# EasyEDA Pro project robot_arm_board.eprj

# Schematic Schematic1
Board Name: Board1; Create Date: 2024-10-25; Page Name: P1; Project Name: robot_arm_board; Schematic Name: Schematic1; Update Date: 2024-11-02; Company: 嘉立创EDA; Page Size: A4; Version: V1.0
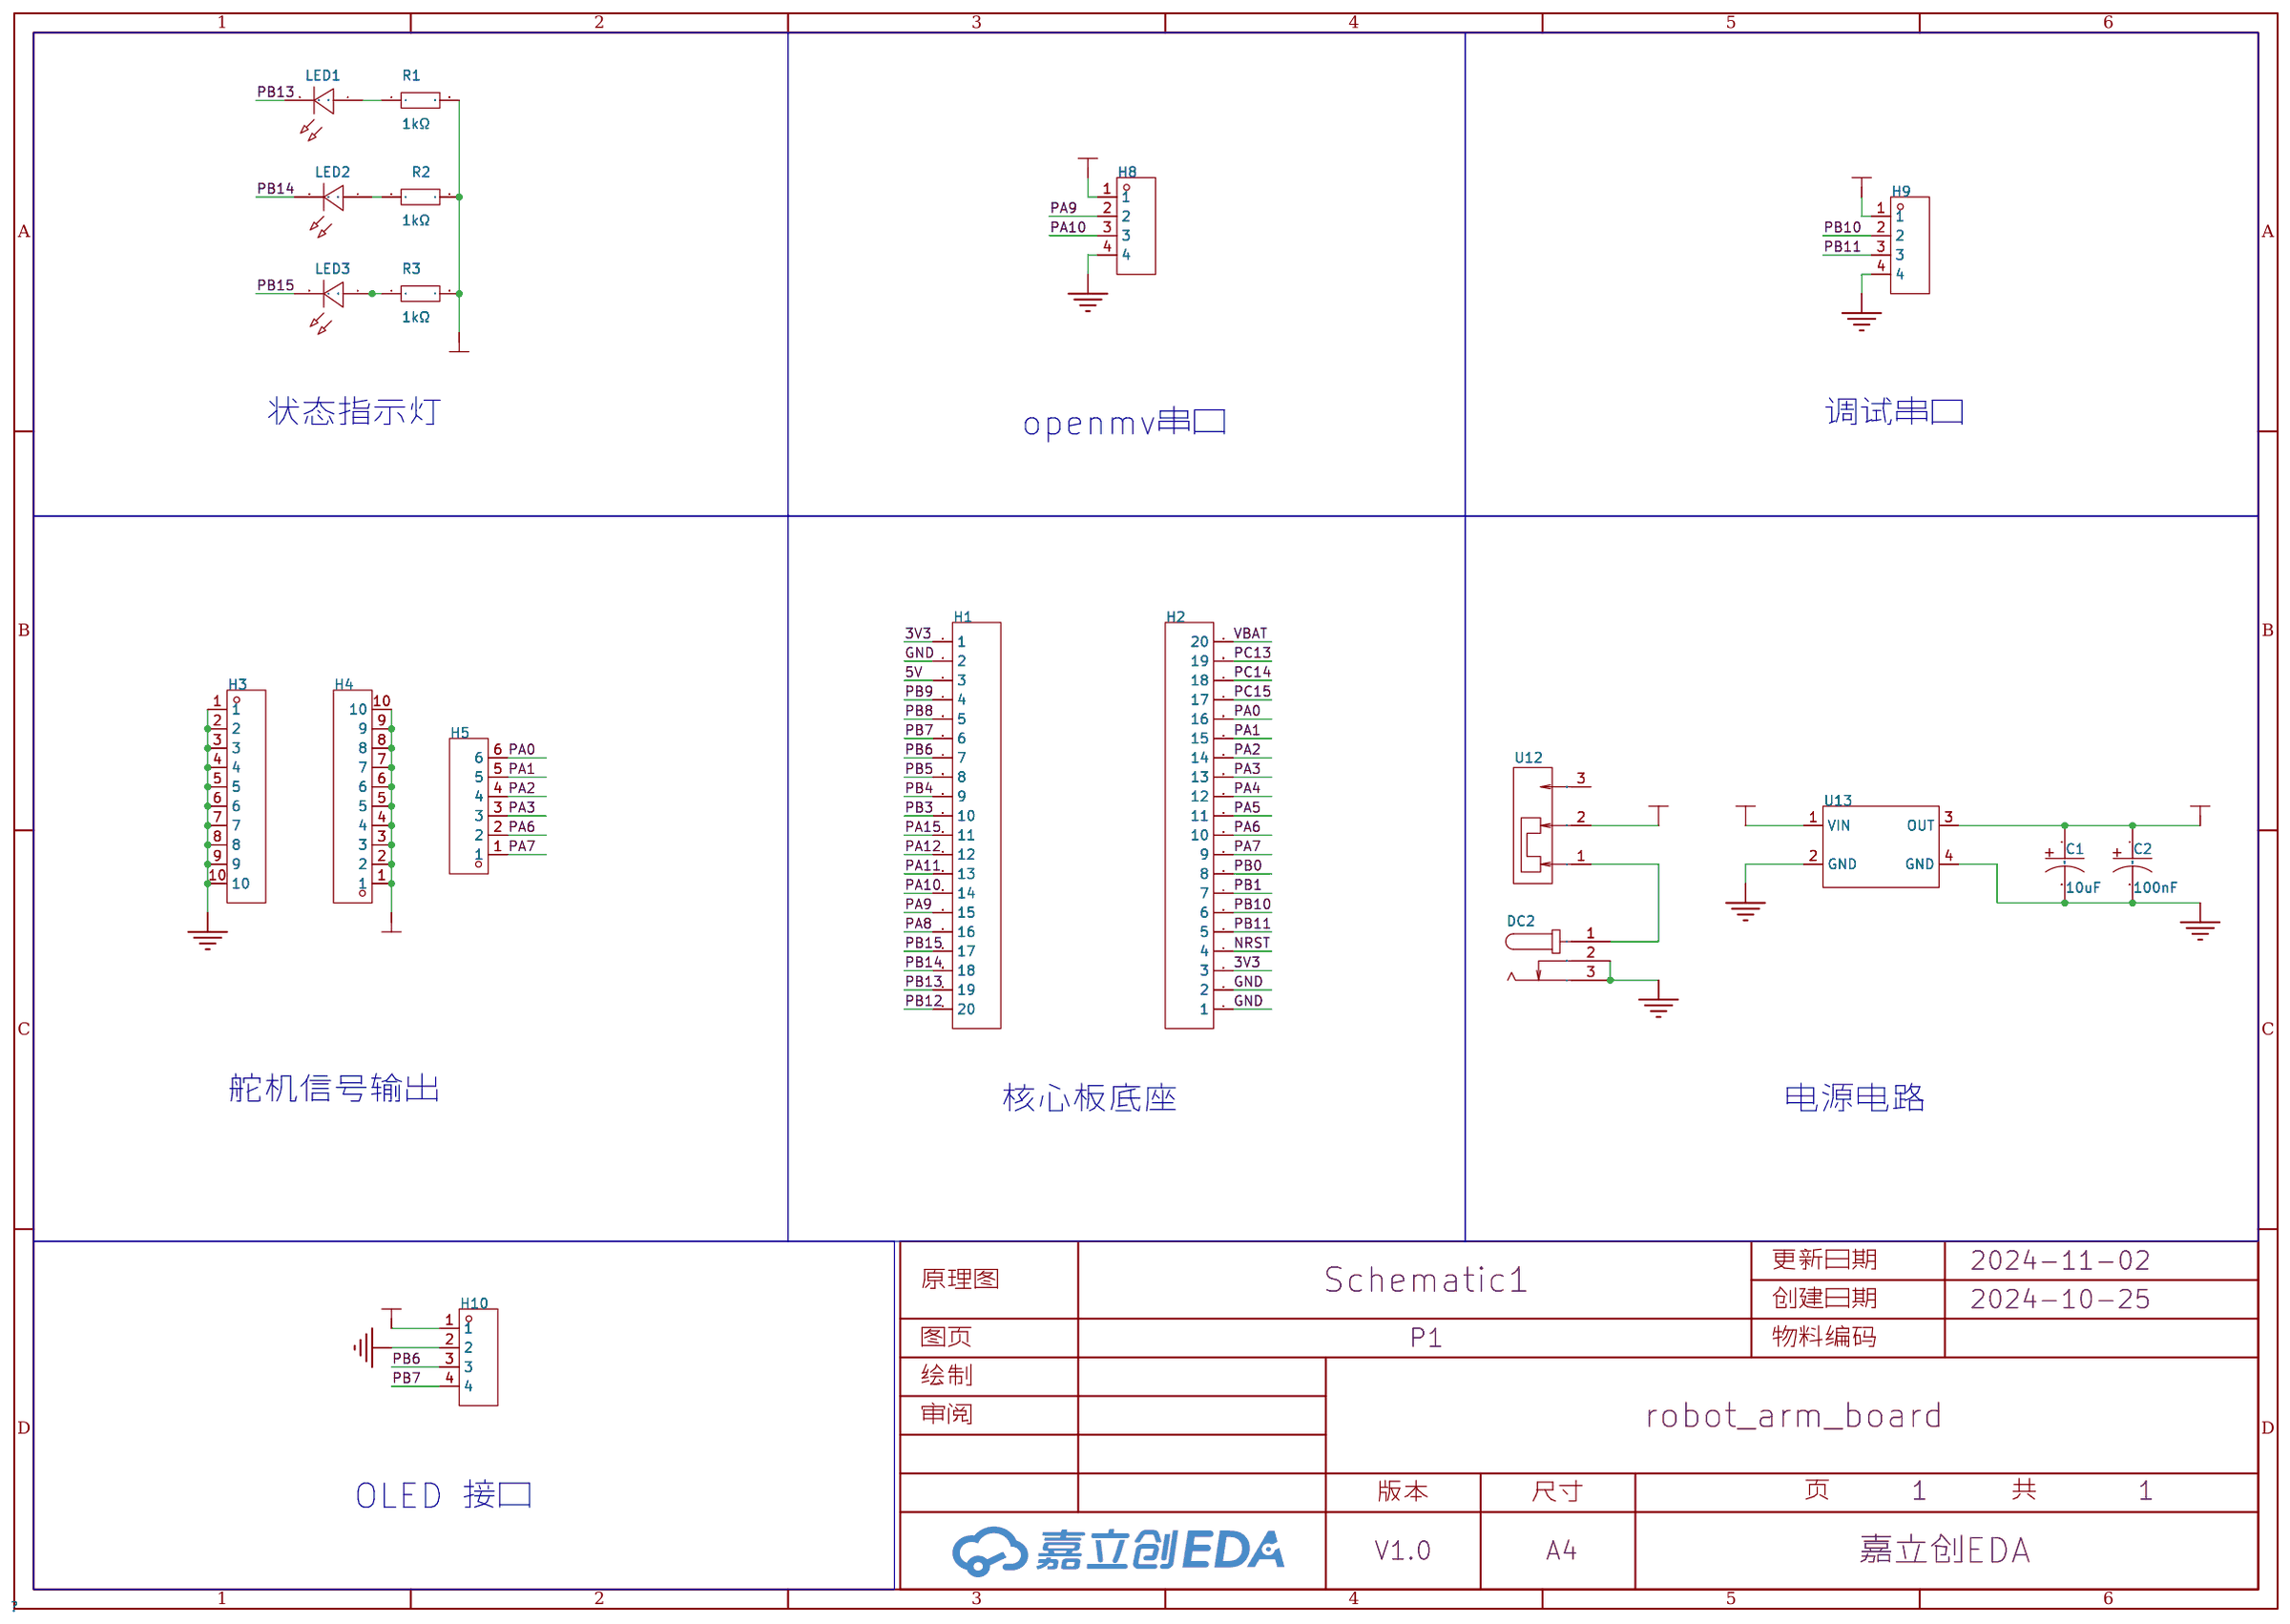
[diagram p0: schematic sheet]

## Parts
C1  10uF  [CAP-TH_BD6.3-P2.50-D0.5-FD]
C2  100nF  [CAP-TH_BD6.3-P2.50-D0.5-FD]
DC2  -  [DC-IN-TH_KH-DC-005-2.5]
H1  -  [HDR-TH_20P-P2.54-V-F]
H2  -  [HDR-TH_20P-P2.54-V-F]
H3  -  [HDR-TH_10P-P2.54-V-F]
H4  -  [HDR-TH_10P-P2.54-V-F]
H5  -  [hdr-th_6p-p2.54-v-f]
H8  -  [hdr-th_4p-p2.54-v-f]
H9  -  [hdr-th_4p-p2.54-v-f]
H10  -  [hdr-th_4p-p2.54-v-f]
LED1  -  [LED_TH-3mm]
LED2  -  [LED_TH-3mm]
LED3  -  [LED_TH-3mm]
R1  1kΩ  [Res_1/8W]
R2  1kΩ  [Res_1/8W]
R3  1kΩ  [Res_1/8W]
U12  SS-12D10-G5  [SW-TH_SS-12D10-G050]
U13  -  [MP1584模块]

## Library data of the parts
C1 C2 = CAP,铝电解电容,470UF,7*12: Supplier Part: C9900003002; Supplier Footprint: CAP-TH_BD6.3-P2.20; JLCPCB Part Class: 扩展库; Supplier: LCSC
DC2 = KH-DC-005-2.5: 连接器类型:DC电源插座;安装方式:弯插;触点内径:-;触点外径:6.4mm;额定电流:1A;额定电压:30V;工作温度范围:-25~+70;; LCSC Part Name: DC电源插座 外径:6.4mm; Supplier Part: C2847170; Manufacturer: kinghelm(金航标); Supplier Footprint: 插件; JLCPCB Part Class: Extended Part; Datasheet: https://atta.szlcsc.com/upload/public/pdf/source/20210716/C2847170_7F0110A0BEDEE81C68B76DF87AC8DA16.pdf; Supplier: LCSC; Connector Type: DC电源插座; Mounting Style: 弯插; Outside Contact Diameter: 6.4mm; Current Rating (Max): 1A; Voltage Rating (Max): 30V; Operating Temperature Range: -25~+70
H1 H2 = HDR-F_2.54_1x20P: Supplier Part: C50984; Supplier Footprint: 插件
H3 H4 = HDR-F_2.54_1x10P: Supplier Part: C2684744; Supplier Footprint: 插件
H5 = HDR-F_2.54_1x6P: Supplier Part: C40877; Supplier Footprint: 插件
H8-H10 = HDR-F_2.54_1x4P: Supplier Part: C2718488; Supplier Footprint: 插件
LED1-LED3 = LED_TH-G_3mm: Supplier Footprint: 插件
R1-R3 = Res_AXIAL-1/8W: Supplier Footprint: 轴向引线
U12 = SS-12D10-G5: 电路结构:单刀双掷;安装方式:直插;开关颜色:黑色;滑钮形状:矩形柱状;引脚样式:PC引脚;开关长度:12.7mm;开关宽度:6.7mm;开关高度:11.3mm;; LCSC Part Name: 插件大电流拨动开关; Supplier Part: C2998777; Manufacturer: DEALON(德艺隆); Supplier Footprint: 插件; JLCPCB Part Class: Extended Part; Datasheet: https://atta.szlcsc.com/upload/public/pdf/source/20220428/E10CB334ACBAF32CF4AF8D87DA871CD3.pdf; Supplier: LCSC; Circuit: 单刀双掷; Mounting Style: 直插; Actuator Color: 黑色; Actuator Style: 矩形柱状; Pin Style: PC引脚; Switch Length: 12.7mm; Switch Width: 6.7mm; Switch Height: 11.3mm
U13 = MP1584模块: Pin Type: IN

## Nets
3V3: H1.1 H2.3 H8.1 H9.1 H10.1 R1.2 R2.2 R3.2
5V: C1.1 C2.1 H1.3 H4.1 H4.2 H4.3 H4.4 H4.5 H4.6 H4.7 H4.8 H4.9 H4.10 U13.3(OUT)
+12V: U12.2 U13.1(VIN)
GND: C1.2 C2.2 DC2.2 DC2.3 H1.2 H2.1 H2.2 H3.1 H3.2 H3.3 H3.4 H3.5 H3.6 H3.7 H3.8 H3.9 H3.10 H8.4 H9.4 H10.2 U13.2(GND) U13.4(GND)
VBAT: H2.20
NRST: H2.4
PA0: H2.16 H5.6
PA1: H2.15 H5.5
PA2: H2.14 H5.4
PA3: H2.13 H5.3
PA4: H2.12
PA5: H2.11
PA6: H2.10 H5.2
PA7: H2.9 H5.1
PA8: H1.16
PA9: H1.15 H8.2
PA10: H1.14 H8.3
PA11: H1.13
PA12: H1.12
PA15: H1.11
PB0: H2.8
PB1: H2.7
PB3: H1.10
PB4: H1.9
PB5: H1.8
PB6: H1.7 H10.3
PB7: H1.6 H10.4
PB8: H1.5
PB9: H1.4
PB10: H2.6 H9.2
PB11: H2.5 H9.3
PB12: H1.20
PB13: H1.19 LED1.2(A)
PB14: H1.18 LED2.2(A)
PB15: H1.17 LED3.2(A)
PC13: H2.19
PC14: H2.18
PC15: H2.17
$1N1996: LED1.1(C) R1.1
$1N2069: LED3.1(C) R3.1
$1N2112: LED2.1(C) R2.1
$1N6431: DC2.1 U12.1

Not connected (* = marked no-connect by the designer): U12 3

## Notes on the sheet
- 状态指示灯
- 调试串口
- openmv串口
- 舵机信号输出
- 核心板底座
- 电源电路
- OLED 接口

# Board PCB1
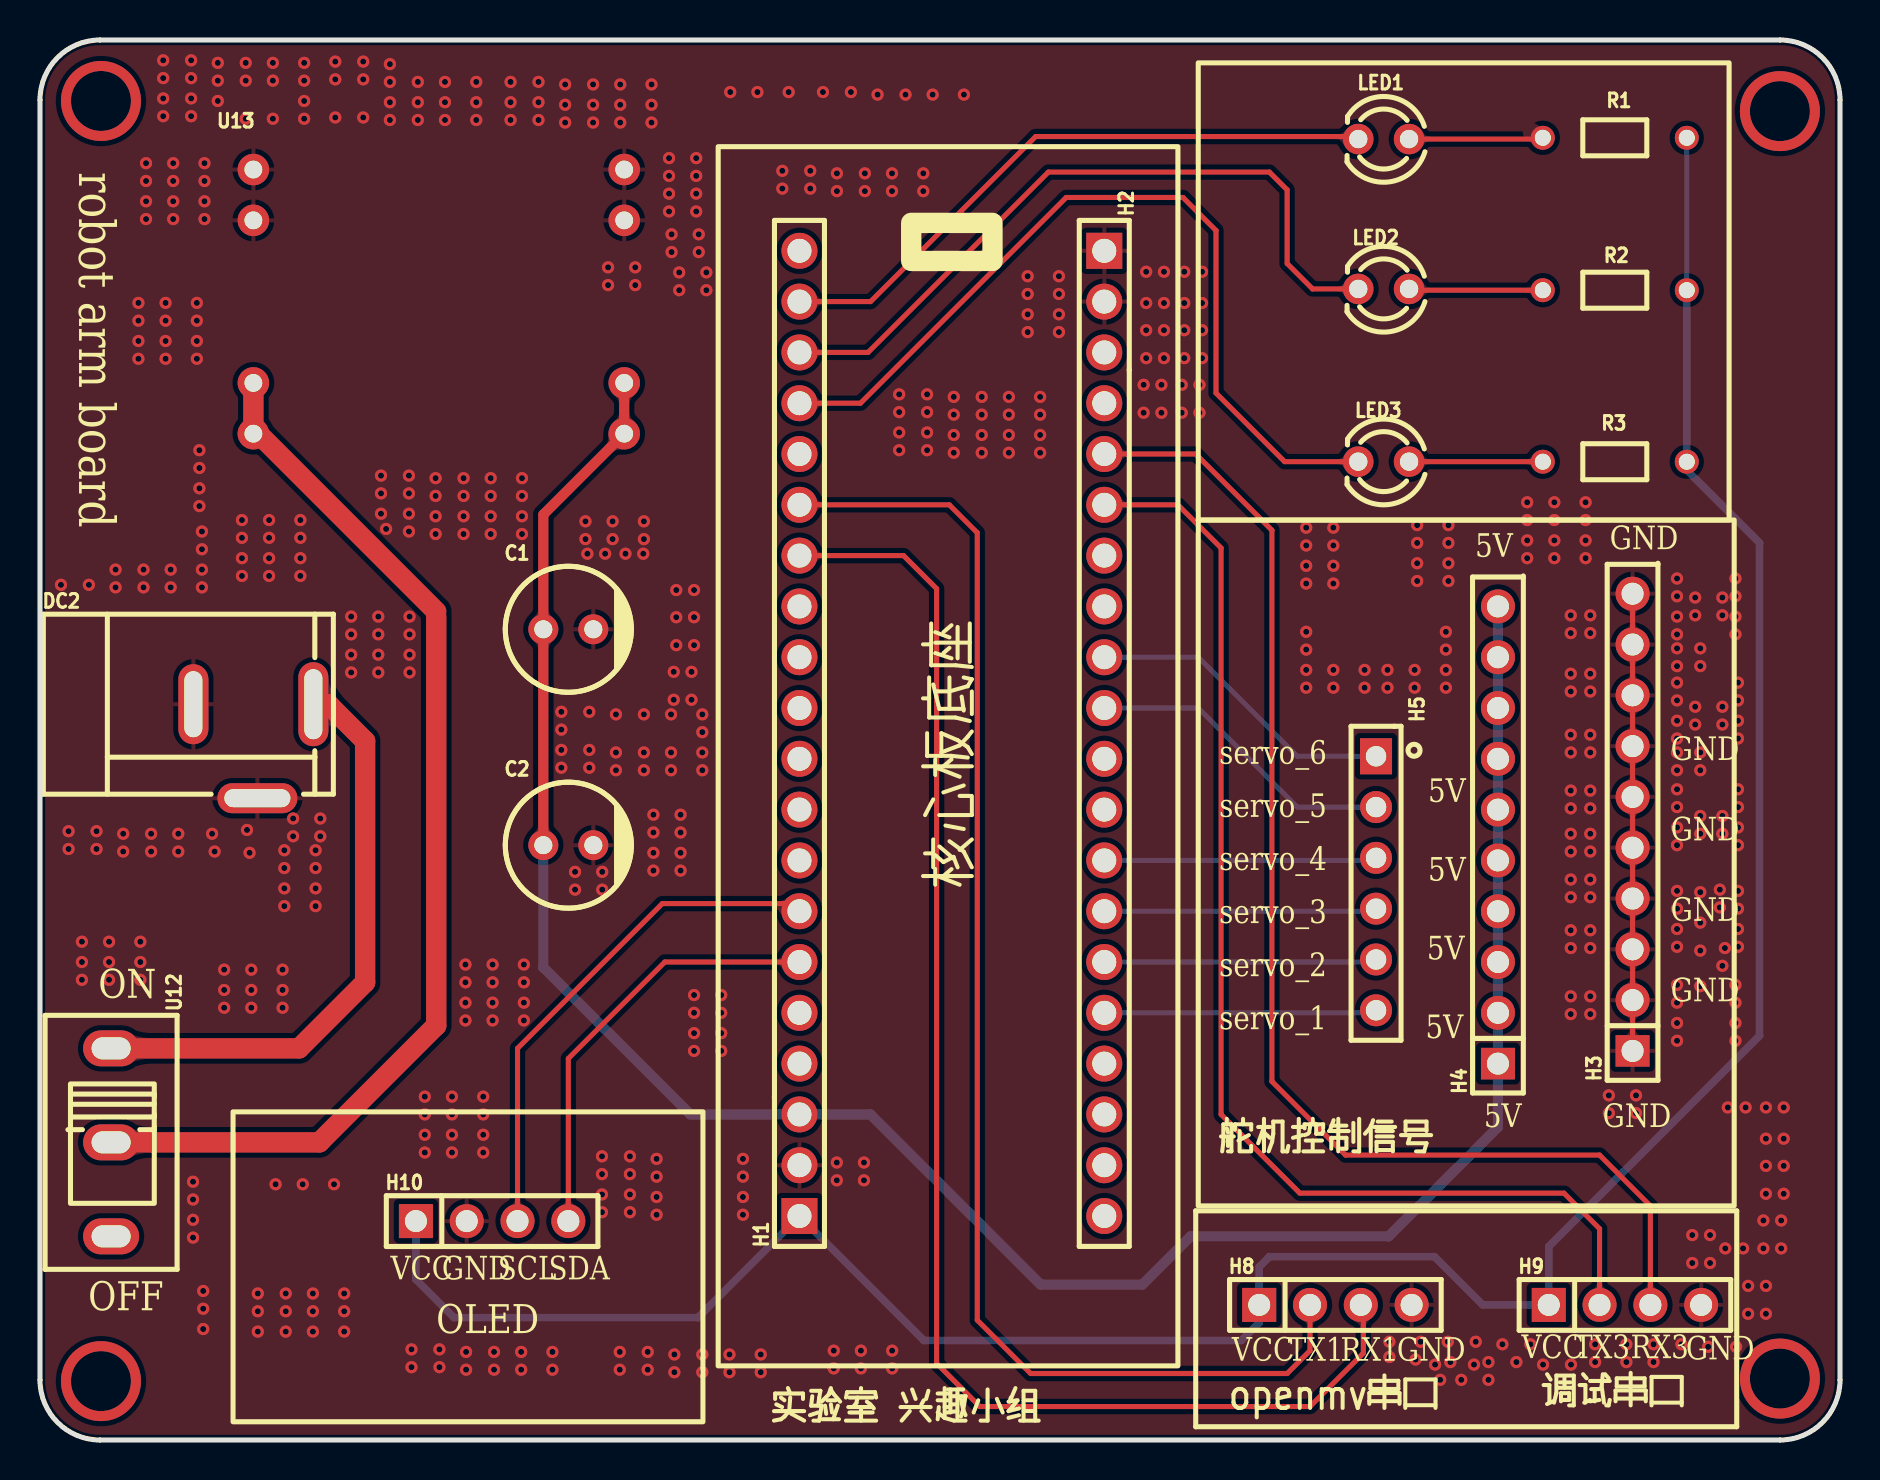
[diagram p1: board, top side]
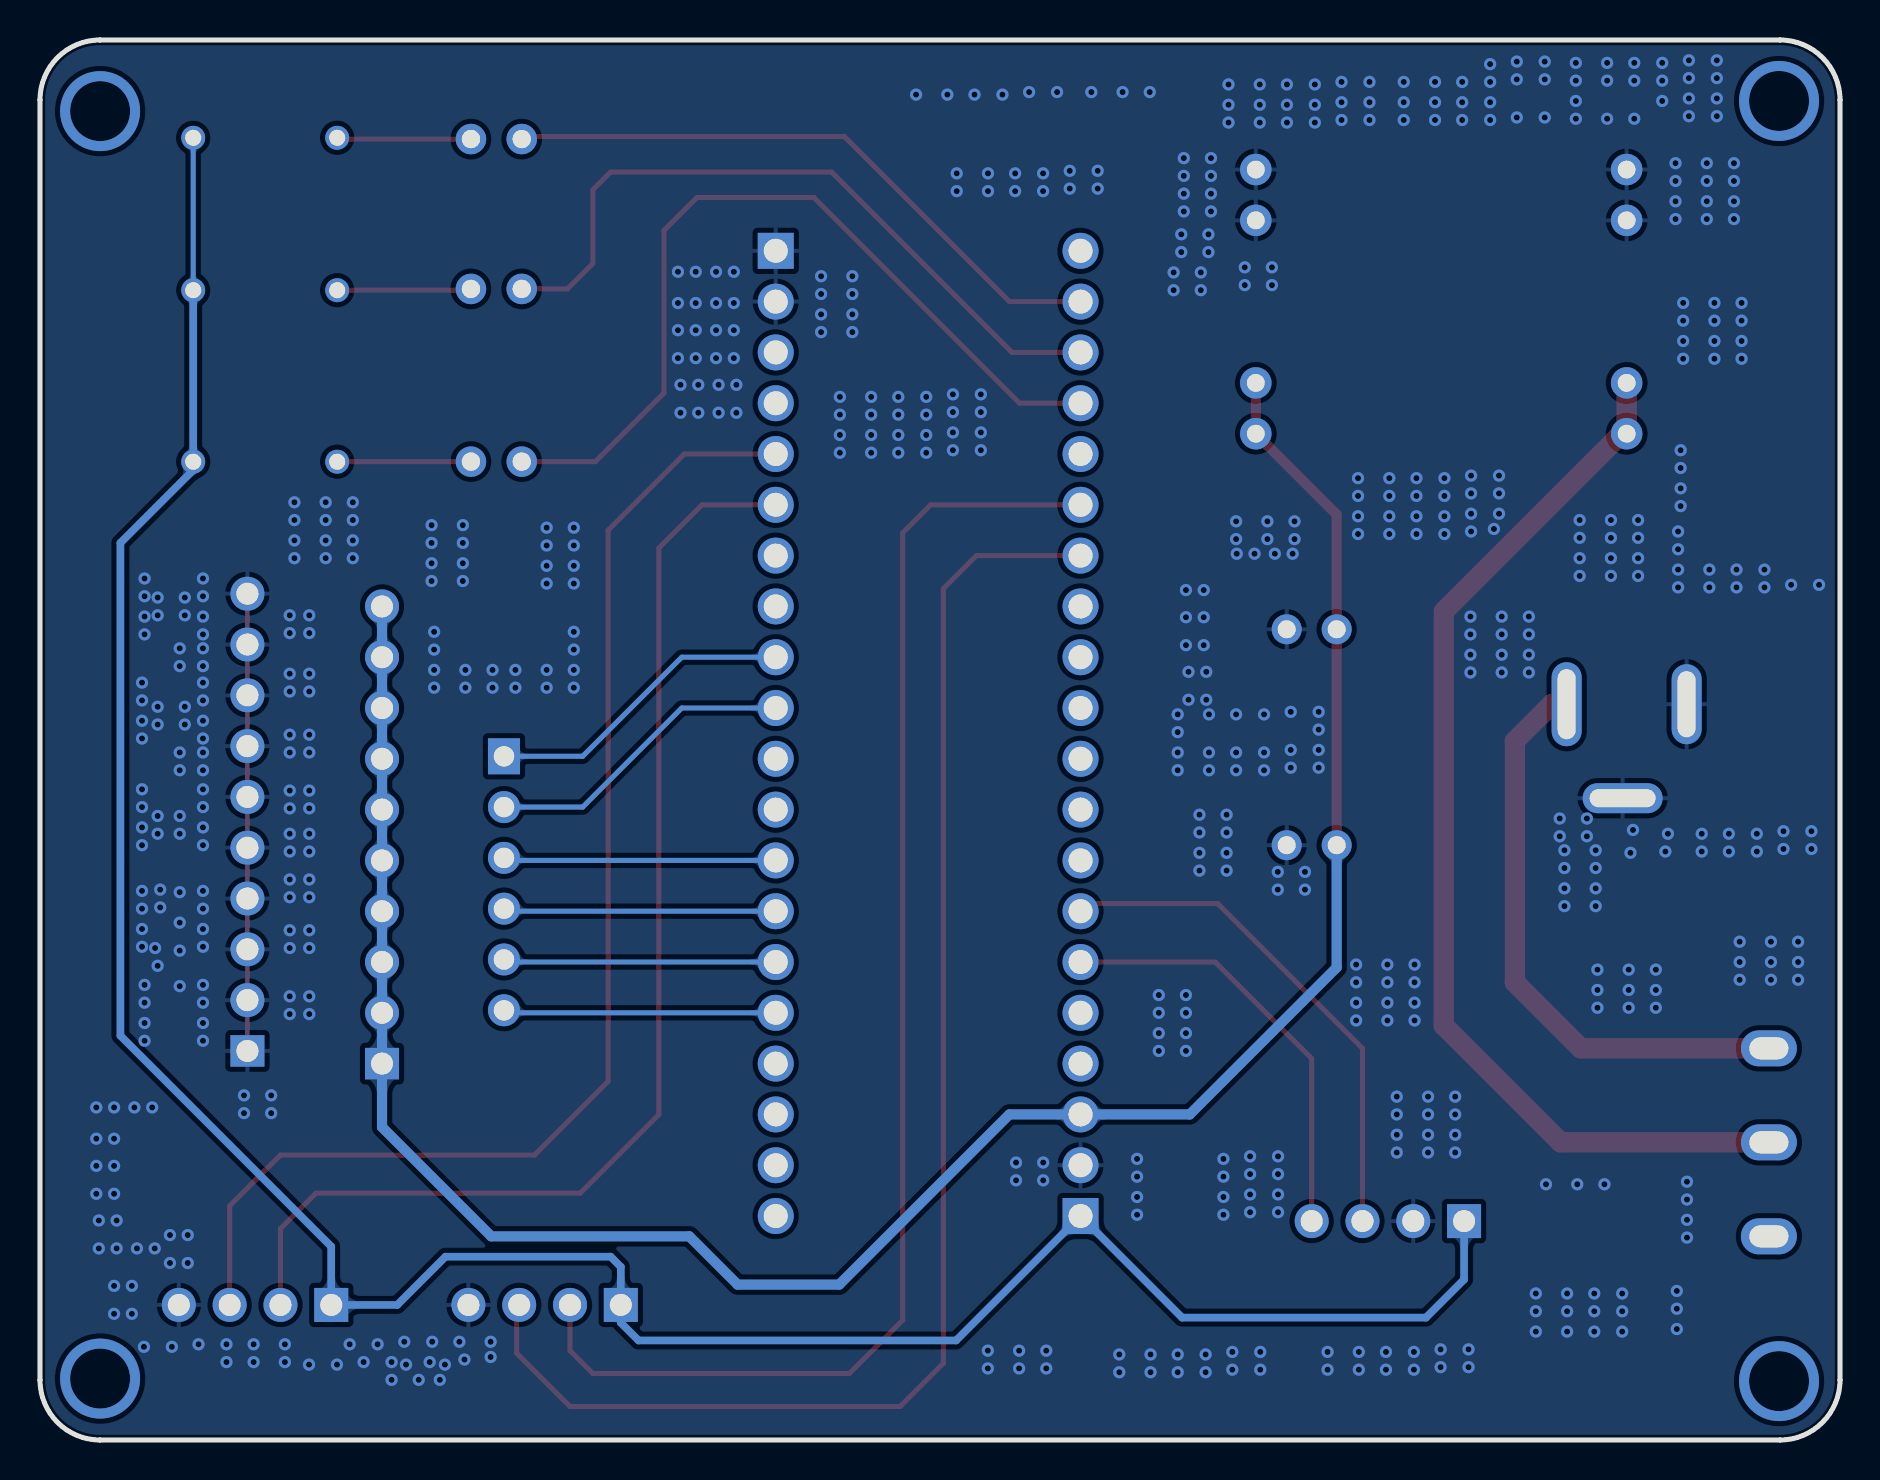
[diagram p2: board, bottom side, seen from below]

Outline 90 x 70 mm; copper layers: Top Layer, Bottom Layer. Coordinates in mm from the lower left corner of the outline.
Outline path: 0,67 0,3 arc(0.88,0.88) 3,0 87,0 arc(89.12,0.88) 90,3 90,67 arc(89.12,69.12) 87,70 3,70 arc(0.88,69.12) 0,67
Stack: Top Layer 0.035mm / Dielectric1 1.51mm FR4 er 4.5 / Bottom Layer 0.035mm

## Design rules (mm)
template: JLCPCB Capability(Two Layers Board)
spacing copperThickness1oz (default): track to track 0.102, other pairs 0.152 to 0.3
spacing copperThickness2oz: track to track 0.203, other pairs 0.152 to 0.3
track width copperThickness1oz (default): min 0.127, default 0.254, max 2.54
track width copperThickness2oz: min 0.203, default 0.254, max 2.54
differential pair differentialPair (default): width min 0.127, default 0.254, max 2.54; gap min 0.152, default 0.152
via viaSize (default): diameter min 0.5, default 0.61, max 10; hole min 0.3, default 0.305, max 6.3

## Placement (name value [footprint] x y rotation side)
C1  10uF  [CAP-TH_BD6.3-P2.50-D0.5-FD]  26.42 40.54 0 top
C2  100nF  [CAP-TH_BD6.3-P2.50-D0.5-FD]  26.42 29.74 0 top
DC2  -  [DC-IN-TH_KH-DC-005-2.5]  10.67 34.44 0 top
H1  -  [HDR-TH_20P-P2.54-V-F]  37.97 35.33 90 top
H2  -  [HDR-TH_20P-P2.54-V-F]  53.21 35.33 270 top
H3  -  [HDR-TH_10P-P2.54-V-F]  79.63 30.88 90 top
H4  -  [HDR-TH_10P-P2.54-V-F]  72.9 30.25 90 top
H5  -  [hdr-th_6p-p2.54-v-f]  66.8 27.84 270 top
H8  -  [hdr-th_4p-p2.54-v-f]  64.77 6.75 0 top
H9  -  [hdr-th_4p-p2.54-v-f]  79.25 6.75 0 top
H10  -  [hdr-th_4p-p2.54-v-f]  22.61 10.94 0 top
LED1  -  [LED_TH-3mm]  67.18 65.05 180 top
LED2  -  [LED_TH-3mm]  67.18 57.55 180 top
LED3  -  [LED_TH-3mm]  67.18 48.92 180 top
R1  1kΩ  [Res_1/8W]  78.74 65.05 0 top
R2  1kΩ  [Res_1/8W]  78.74 57.43 0 top
R3  1kΩ  [Res_1/8W]  78.74 48.85 0 top
U12  SS-12D10-G5  [SW-TH_SS-12D10-G050]  3.56 14.88 270 top
U13  -  [MP1584模块]  19.94 56.92 0 top

## Footprints (pads in the part's own frame, mm; a bottom-side part is the same pattern mirrored in y, then rotated)
CAP-TH_BD6.3-P2.50-D0.5-FD
  round 1.5 hole 0.9: 1(-1.25,0) 2(1.25,0)
DC-IN-TH_KH-DC-005-2.5
  oval 1.501x4.201 hole 0.899x3.5: 1(2.999,2.349)
  oval 1.501x4 hole 0.899x3.3: 2(-2.999,2.349)
  oval 4x1.501 hole 3.3x0.899: 3(0.201,-2.349)
hdr-th_4p-p2.54-v-f
  rect 1.7x1.7 hole 1.1: 1(-3.81,0)
  round 1.7 hole 1.1: 2(-1.27,0) 3(1.27,0) 4(3.81,0)
hdr-th_6p-p2.54-v-f
  rect 1.8x1.6 hole 1.02: 1(-6.35,0)
  round 1.6 hole 1.02: 2(-3.81,0) 3(-1.27,0) 4(1.27,0) 5(3.81,0) 6(6.35,0)
HDR-TH_10P-P2.54-V-F
  rect 1.575x1.7 hole 1.1: 1(-11.43,0)
  round 1.7 hole 1.1: 2(-8.89,0) 3(-6.35,0) 4(-3.81,0) 5(-1.27,0) 6(1.27,0) 7(3.81,0) 8(6.35,0) 9(8.89,0) 10(11.43,0)
HDR-TH_20P-P2.54-V-F
  rect 1.8x1.8 hole 1.2: 1(-24.13,0)
  round 1.8 hole 1.2: 2(-21.59,0) 3(-19.05,0) 4(-16.51,0) 5(-13.97,0) 6(-11.43,0) 7(-8.89,0) 8(-6.35,0) 9(-3.81,0) 10(-1.27,0) 11(1.27,0) 12(3.81,0) 13(6.35,0) 14(8.89,0) 15(11.43,0) 16(13.97,0) 17(16.51,0) 18(19.05,0) 19(21.59,0) 20(24.13,0)
LED_TH-3mm
  round 1.524 hole 0.914: 1(-1.27,0) 2(1.27,0)
MP1584模块
  round 1.575 hole 0.889: 1(-9.271,-4.064) 1(-9.271,-6.604) 2(-9.271,6.604) 2(-9.271,4.064) 3(9.271,-4.064) 3(9.271,-6.604) 4(9.271,6.604) 4(9.271,4.064)
Res_1/8W
  round 1.199 hole 0.8: 1(-3.599,0.063) 2(3.599,0.063)
SW-TH_SS-12D10-G050
  oval 1.8x2.8 hole 1.1x1.95: 1(-4.7,0) 2(0,0) 3(4.7,0)

## Nets
As in the schematic.

Pads without a net: U12 3

## Via types
v1: diameter 4, hole 3, Top Layer to Bottom Layer, 4 vias
v2: diameter 0.61, hole 0.305, Top Layer to Bottom Layer, 642 vias

## Routing (per net, layer and track width the routed paths; a pad name or vN(x,y) marks a point on that pad's centre or on a via; arc(x,y) is an arc through that point)
3V3: length 133.6
  Bottom Layer w0.254: R1.2 R2.2
  Bottom Layer w0.381: R2.2 R3.2 82.34,48.49 85.98,44.85 85.98,20.22 75.44,9.68 H9.1 72.14,6.75 69.72,9.17 61.47,9.17 60.96,8.66 H8.1 60.96,5.87 60.07,4.98 44.2,4.98 37.97,11.2 32.89,6.12 20.7,6.12 18.8,8.02 H10.1
5V: length 114.5
  Top Layer w0.508: 29.21,52.86 U13.3 25.17,46.27 C1.1 C2.1
  Bottom Layer w0.508: H4.10 H4.9 H4.7 H4.5 H4.4 H4.3 H4.2 72.9,15.64 67.44,10.18 57.53,10.18 55.12,7.77 50.04,7.77 41.53,16.28 H1.3 32.51,16.28 25.17,23.62 C2.1
+12V: length 54.5
  Top Layer w1.016: 19.81,41.42 10.92,50.31 U13.1 10.67,52.86 ; 19.81,41.17 19.81,20.72 13.97,14.88 U12.2
GND: length 22.9
  Top Layer w0.254: H3.1 H3.2 H3.3 H3.4 H3.5 H3.6 H3.7 H3.8 H3.9 H3.10
  vias: v2(1.05,42.76) v2(1.43,30.44) v2(1.43,29.55) v2(2.1,24.92) v2(2.1,23.9) v2(2.1,23.01) v2(2.44,42.76) v2(2.83,30.44) v2(2.83,29.55) v2(3.45,24.92) v2(3.45,23.9) v2(3.45,23.01) v2(3.78,43.52) v2(3.78,42.63) v2(4.16,30.31) v2(4.16,29.42) v2(4.92,56.86) v2(4.92,55.97) v2(4.92,54.95) v2(4.92,54.06) v2(5.02,24.92) v2(5.02,23.9) v2(5.02,23.01) v2(5.18,43.52) v2(5.18,42.63) v2(5.3,63.84) v2(5.3,62.95) v2(5.3,61.94) v2(5.3,61.05) v2(5.56,30.31) v2(5.56,29.42) v2(6.16,68.98) v2(6.16,68.09) v2(6.16,67.08) v2(6.16,66.19) v2(6.28,56.86) v2(6.28,55.97) v2(6.28,54.95) v2(6.28,54.06) v2(6.53,43.52) v2(6.53,42.63) v2(6.66,63.84) v2(6.66,62.95) v2(6.66,61.94) v2(6.66,61.05) v2(6.91,30.31) v2(6.91,29.42) v2(7.56,68.98) v2(7.56,68.09) v2(7.56,67.08) v2(7.56,66.19) v2(7.65,12.91) v2(7.65,12.02) v2(7.65,11.01) v2(7.65,10.12) v2(7.84,56.86) v2(7.84,55.97) v2(7.84,54.95) v2(7.84,54.06) v2(7.97,49.49) v2(7.97,48.6) v2(7.97,47.58) v2(7.97,46.7) v2(8.1,45.43) v2(8.1,44.54) v2(8.1,43.52) v2(8.1,42.63) v2(8.22,63.84) v2(8.22,62.95) v2(8.22,61.94) v2(8.22,61.05) v2(8.16,7.45) v2(8.16,6.56) v2(8.16,5.55) v2(8.6,30.31) v2(8.73,29.42) v2(8.89,68.86) v2(8.89,67.97) v2(8.89,66.95) v2(9.21,23.52) v2(9.21,22.5) v2(9.21,21.61) v2(10.1,46) v2(10.1,45.11) v2(10.1,44.09) v2(10.1,43.2) v2(10.29,68.86) v2(10.29,67.97) v2(10.29,66.06) v2(10.35,30.5) v2(10.48,29.36) v2(10.56,23.52) v2(10.56,22.5) v2(10.56,21.61) v2(10.89,7.33) v2(10.89,6.44) v2(10.89,5.42) v2(11.45,46) v2(11.45,45.11) v2(11.45,44.09) v2(11.45,43.2) v2(11.64,68.86) v2(11.64,67.97) v2(11.64,66.06) v2(11.78,12.79) v2(12.13,23.52) v2(12.13,22.5) v2(12.13,21.61) v2(12.22,29.49) v2(12.22,28.6) v2(12.22,27.58) v2(12.22,26.69) v2(12.29,7.33) v2(12.29,6.44) v2(12.29,5.42) v2(12.66,31.07) v2(12.66,30.19) v2(13.02,46) v2(13.02,45.11) v2(13.02,44.09) v2(13.02,43.2) v2(13.14,12.79) v2(13.21,68.86) v2(13.21,67.97) v2(13.21,66.95) v2(13.21,66.06) v2(13.64,7.33) v2(13.64,6.44) v2(13.64,5.42) v2(13.78,29.49) v2(13.78,28.6) v2(13.78,27.58) v2(13.78,26.69) v2(14.01,31.07) v2(14.01,30.19) v2(14.7,12.79) v2(14.76,68.92) v2(14.76,68.03) v2(14.76,66.13) v2(15.21,7.33) v2(15.21,6.44) v2(15.21,5.42) v2(15.56,41.17) v2(15.56,40.28) v2(15.56,39.27) v2(15.56,38.38) v2(16.16,68.92) v2(16.16,68.03) v2(16.16,66.13) v2(16.92,41.17) v2(16.92,40.28) v2(16.92,39.27) v2(16.92,38.38) v2(17.05,48.22) v2(17.05,47.33) v2(17.05,46.31) v2(17.3,45.55) v2(17.49,68.79) v2(17.49,67.9) v2(17.49,66.89) v2(17.49,66) v2(18.45,48.22) v2(18.45,47.33) v2(18.45,46.31) v2(18.45,45.43) v2(18.48,41.17) v2(18.48,40.28) v2(18.48,39.27) v2(18.48,38.38) v2(18.57,4.53) v2(18.57,3.64) v2(18.89,67.9) v2(18.89,66.89) v2(18.89,66) v2(19.24,17.17) v2(19.24,16.28) v2(19.24,15.26) v2(19.24,14.37) v2(19.78,48.09) v2(19.78,47.2) v2(19.78,46.19) v2(19.78,45.3) v2(19.97,4.53) v2(19.97,3.64) v2(20.25,67.9) v2(20.25,66.89) v2(20.25,66) v2(20.6,17.17) v2(20.6,16.28) v2(20.6,15.26) v2(20.6,14.37) v2(21.18,48.09) v2(21.18,47.2) v2(21.18,46.19) v2(21.18,45.3) v2(21.27,23.77) v2(21.27,22.88) v2(21.27,21.87) v2(21.27,20.98) v2(21.3,4.4) v2(21.3,3.52) v2(21.81,67.9) v2(21.81,66.89) v2(21.81,66) v2(22.16,17.17) v2(22.16,16.28) v2(22.16,15.26) v2(22.16,14.37) v2(22.53,48.09) v2(22.53,47.2) v2(22.53,46.19) v2(22.53,45.3) v2(22.63,23.77) v2(22.63,22.88) v2(22.63,21.87) v2(22.63,20.98) v2(22.7,4.4) v2(22.7,3.52) v2(23.53,67.9) v2(23.53,66.89) v2(23.53,66) v2(24.1,48.09) v2(24.1,47.2) v2(24.1,46.19) v2(24.1,45.3) v2(24.06,4.4) v2(24.06,3.52) v2(24.19,23.77) v2(24.19,22.88) v2(24.19,21.87) v2(24.19,20.98) v2(24.92,67.9) v2(24.92,66.89) v2(24.92,66) v2(25.62,4.4) v2(25.62,3.52) v2(26.07,36.41) v2(26.07,35.52) v2(26.07,34.5) v2(26.07,33.61) v2(26.26,67.78) v2(26.26,66.76) v2(26.26,65.87) v2(26.75,28.41) v2(26.75,27.52) v2(27.27,45.93) v2(27.27,45.04) v2(27.37,44.31) v2(27.46,36.41) v2(27.46,34.5) v2(27.46,33.61) v2(27.65,67.78) v2(27.65,66.76) v2(27.65,65.87) v2(28.11,28.41) v2(28.11,27.52) v2(28.1,14.18) v2(28.1,13.29) v2(28.1,12.28) v2(28.1,11.39) v2(28.26,44.31) v2(28.4,58.63) v2(28.4,57.74) v2(28.63,45.93) v2(28.63,45.04) v2(28.8,36.28) v2(28.8,34.38) v2(28.8,33.49) v2(29.01,67.78) v2(29.01,66.76) v2(29.01,65.87) v2(28.99,4.4) v2(28.99,3.52) v2(29.27,44.31) v2(29.5,14.18) v2(29.5,13.29) v2(29.5,12.28) v2(29.5,11.39) v2(29.76,58.63) v2(29.76,57.74) v2(30.19,45.93) v2(30.19,45.04) v2(30.16,44.31) v2(30.19,36.28) v2(30.19,34.38) v2(30.19,33.49) v2(30.38,4.4) v2(30.38,3.52) v2(30.58,67.78) v2(30.58,66.76) v2(30.58,65.87) v2(30.67,31.27) v2(30.67,30.38) v2(30.67,29.36) v2(30.67,28.47) v2(30.83,14.06) v2(30.83,13.17) v2(30.83,12.15) v2(30.83,11.26) v2(31.45,64.09) v2(31.45,63.21) v2(31.45,62.32) v2(31.45,61.43) v2(31.58,60.28) v2(31.58,59.4) v2(31.55,36.28) v2(31.55,34.38) v2(31.55,33.49) v2(31.69,38.41) v2(31.69,37.01) v2(31.72,4.28) v2(31.72,3.39) v2(31.81,42.5) v2(31.81,41.14) v2(31.81,39.74) v2(31.96,58.38) v2(31.96,57.49) v2(32.03,31.27) v2(32.03,30.38) v2(32.03,29.36) v2(32.03,28.47) v2(32.58,38.41) v2(32.58,37.01) v2(32.7,42.5) v2(32.7,41.14) v2(32.7,39.74) v2(32.7,22.25) v2(32.7,21.36) v2(32.7,20.34) v2(32.7,19.45) v2(32.81,64.09) v2(32.81,63.21) v2(32.81,62.32) v2(32.81,61.43) v2(32.94,60.28) v2(32.94,59.4) v2(33.12,36.28) v2(33.12,35.39) v2(33.12,34.38) v2(33.12,33.49) v2(33.12,4.28) v2(33.12,3.39) v2(33.32,58.38) v2(33.32,57.49) v2(34.06,22.25) v2(34.06,21.36) v2(34.06,20.34) v2(34.06,19.45) v2(34.51,67.4) v2(34.47,4.28) v2(34.47,3.39) v2(35.15,14.06) v2(35.15,13.17) v2(35.15,12.15) v2(35.15,11.26) v2(35.87,67.4) v2(36.04,4.28) v2(36.04,3.39) v2(37.12,63.46) v2(37.12,62.57) v2(37.43,67.4) v2(38.51,63.46) v2(38.51,62.57) v2(39.15,67.4) v2(39.69,4.47) v2(39.69,3.58) v2(39.85,63.33) v2(39.85,62.44) v2(39.84,13.87) v2(39.84,12.98) v2(40.54,67.4) v2(41.04,4.47) v2(41.04,3.58) v2(41.24,63.33) v2(41.24,62.44) v2(41.2,13.87) v2(41.2,12.98) v2(41.88,67.27) v2(42.6,63.33) v2(42.6,62.44) v2(42.61,4.47) v2(42.61,3.58) v2(42.96,52.28) v2(42.96,51.39) v2(42.96,50.38) v2(42.96,49.49) v2(43.28,67.27) v2(44.16,63.33) v2(44.16,62.44) v2(44.35,52.28) v2(44.35,51.39) v2(44.35,50.38) v2(44.35,49.49) v2(44.63,67.27) v2(45.69,52.16) v2(45.69,51.27) v2(45.69,50.25) v2(45.69,49.36) v2(46.2,67.27) v2(47.09,52.16) v2(47.09,51.27) v2(47.09,50.25) v2(47.09,49.36) v2(48.44,52.16) v2(48.44,51.27) v2(48.44,50.25) v2(48.44,49.36) v2(49.38,58.19) v2(49.38,57.3) v2(49.38,56.28) v2(49.38,55.39) v2(50.01,52.16) v2(50.01,51.27) v2(50.01,50.25) v2(50.01,49.36) v2(50.95,58.19) v2(50.95,57.3) v2(50.95,56.28) v2(50.95,55.39) v2(55.18,52.76) v2(55.18,51.36) v2(55.31,58.41) v2(55.31,56.85) v2(55.31,55.49) v2(55.31,54.09) v2(56.07,52.76) v2(56.07,51.36) v2(56.2,58.41) v2(56.2,56.85) v2(56.2,55.49) v2(56.2,54.09) v2(57.09,52.76) v2(57.09,51.36) v2(57.21,58.41) v2(57.21,56.85) v2(57.21,55.49) v2(57.21,54.09) v2(57.98,52.76) v2(57.98,51.36) v2(58.1,58.41) v2(58.1,56.85) v2(58.1,55.49) v2(58.1,54.09) v2(63.31,45.62) v2(63.31,44.73) v2(63.31,43.71) v2(63.31,42.82) v2(63.31,40.41) v2(63.31,39.52) v2(63.31,38.5) v2(63.31,37.61) v2(64.67,45.62) v2(64.67,44.73) v2(64.67,43.71) v2(64.67,42.82) v2(64.67,38.5) v2(64.67,37.61) v2(66.23,38.5) v2(66.23,37.61) v2(67.37,38.5) v2(67.37,37.61) v2(67.47,4.91) v2(67.47,4.15) v2(68.73,38.5) v2(68.73,37.61) v2(68.78,4.02) v2(68.86,45.74) v2(68.86,44.85) v2(68.86,43.84) v2(68.86,42.95) v2(69.03,4.91) v2(69.75,3.77) v2(70.01,3.01) v2(70.29,40.41) v2(70.29,39.52) v2(70.29,38.5) v2(70.29,37.61) v2(70.42,45.74) v2(70.42,44.85) v2(70.42,43.84) v2(70.42,42.95) v2(70.39,4.91) v2(70.52,3.9) v2(71.06,3.01) v2(71.7,3.77) v2(71.79,4.91) v2(72.42,3.9) v2(72.42,3.01) v2(73.12,4.79) v2(73.82,3.9) v2(74.36,46.89) v2(74.36,46) v2(74.36,44.98) v2(74.36,44.09) v2(74.52,4.79) v2(75.15,3.77) v2(75.72,46.89) v2(75.72,46) v2(75.72,44.98) v2(75.72,44.09) v2(76.54,41.23) v2(76.54,40.35) v2(76.54,38.31) v2(76.54,37.42) v2(76.54,35.27) v2(76.54,34.38) v2(76.54,32.47) v2(76.54,31.58) v2(76.54,30.31) v2(76.54,29.42) v2(76.54,28.03) v2(76.54,27.14) v2(76.54,25.49) v2(76.54,24.6) v2(76.54,22.18) v2(76.54,21.3) v2(76.55,3.77) v2(77.28,46.89) v2(77.28,46) v2(77.28,44.98) v2(77.28,44.09) v2(77.51,41.23) v2(77.51,40.35) v2(77.51,38.31) v2(77.51,37.42) v2(77.51,35.27) v2(77.51,34.38) v2(77.51,32.47) v2(77.51,31.58) v2(77.51,30.31) v2(77.51,29.42) v2(77.51,28.03) v2(77.51,27.14) v2(77.51,25.49) v2(77.51,24.6) v2(77.51,22.18) v2(77.51,21.3) v2(77.76,4.79) v2(77.76,3.9) v2(78.44,17.23) v2(78.44,16.34) v2(79.32,4.79) v2(79.32,3.9) v2(79.8,17.23) v2(79.8,16.34) v2(80.68,4.79) v2(80.68,3.9) v2(81.85,43.08) v2(81.85,42.19) v2(81.85,41.17) v2(81.85,40.28) v2(81.85,39.58) v2(81.85,38.69) v2(81.85,37.87) v2(81.85,36.98) v2(81.85,35.96) v2(81.85,35.08) v2(81.85,34.38) v2(81.85,33.49) v2(81.85,32.53) v2(81.85,31.65) v2(81.85,30.63) v2(81.85,29.74) v2(81.85,27.45) v2(81.85,26.57) v2(81.85,25.55) v2(81.85,24.66) v2(81.85,22.76) v2(81.85,21.87) v2(81.85,20.85) v2(81.85,19.96) v2(82.07,4.79) v2(82.61,10.25) v2(82.61,8.85) v2(82.76,42.12) v2(82.76,41.23) v2(82.76,36.66) v2(82.76,35.77) v2(83.01,39.58) v2(83.01,38.69) v2(83.01,34.38) v2(83.01,33.49) v2(83.01,31.2) v2(83.01,30.31) v2(83.01,27.39) v2(83.01,25.87) v2(83.01,24.47) v2(83.01,22.69) v2(83.41,4.66) v2(83.5,10.25) v2(83.5,8.85) v2(83.99,27.52) v2(83.99,26.63) v2(84.12,42.12) v2(84.12,41.23) v2(84.12,36.66) v2(84.12,35.77) v2(84.12,31.2) v2(84.12,30.31) v2(84.12,23.71) v2(84.25,24.6) v2(84.26,9.58) v2(84.39,16.63) v2(84.77,43.08) v2(84.77,42.19) v2(84.77,41.17) v2(84.77,40.28) v2(84.77,22.76) v2(84.77,21.87) v2(84.77,20.85) v2(84.77,19.96) v2(84.8,4.66) v2(84.9,37.87) v2(84.9,36.98) v2(84.9,35.96) v2(84.9,35.08) v2(84.9,32.53) v2(84.9,31.65) v2(84.9,30.63) v2(84.9,29.74) v2(84.9,27.45) v2(84.9,26.57) v2(84.9,25.55) v2(84.9,24.66) v2(85.15,9.58) v2(85.28,16.63) v2(85.41,7.71) v2(85.41,6.31) v2(86.17,10.98) v2(86.17,9.58) v2(86.3,16.63) v2(86.3,15.06) v2(86.3,13.71) v2(86.3,12.31) v2(86.3,7.71) v2(86.3,6.31) v2(87.06,10.98) v2(87.06,9.58) v2(87.19,16.63) v2(87.19,15.06) v2(87.19,13.71) v2(87.19,12.31)
(no net):
  vias: v1(3.05,66.95) v1(3.05,2.94) v1(87,66.44) v1(87,3.07)
PA0: length 13.6
  Bottom Layer w0.254: H2.16 66.68,21.36 H5.6
PA1: length 13.6
  Bottom Layer w0.254: H5.5 66.68,23.9 H2.15
PA2: length 13.6
  Bottom Layer w0.254: H5.4 66.68,26.44 H2.14
PA3: length 13.6
  Bottom Layer w0.254: H5.3 66.68,28.98 H2.13
PA6: length 15.6
  Bottom Layer w0.254: 53.21,36.6 57.91,36.6 62.87,31.65 H5.2
PA7: length 15.6
  Bottom Layer w0.254: H5.1 62.87,34.19 57.91,39.14 H2.9
PA9: length 69.3
  Top Layer w0.254: 37.97,46.76 45.47,46.76 46.86,45.36 46.86,5.99 49.53,3.32 62.36,3.32 63.5,4.47 H8.2
PA10: length 72.1
  Top Layer w0.254: H1.14 43.18,44.22 44.83,42.57 44.83,3.83 46.99,1.67 63.5,1.67 66.17,4.34 66.17,6.63 H8.3
PB6: length 25.9
  Top Layer w0.254: H10.3 23.88,19.58 31.12,26.82 37.59,26.82 H1.7
PB7: length 21.7
  Top Layer w0.254: H1.6 31.24,23.9 26.42,19.07 H10.4
PB10: length 60.2
  Top Layer w0.254: 53.21,46.76 56.9,46.76 59.06,44.6 59.06,16.28 62.99,12.34 76.2,12.34 77.98,10.56 H9.2
PB11: length 64
  Top Layer w0.254: H9.3 80.52,11.71 77.98,14.25 65.28,14.25 61.59,17.93 61.59,45.49 57.78,49.3 53.21,49.3
PB13: length 31.4
  Top Layer w0.254: H1.19 41.53,56.92 49.78,65.17 65.79,65.17 LED1.2
PB14: length 36.3
  Top Layer w0.254: LED2.2 63.63,57.55 62.36,58.82 62.36,62.51 61.47,63.4 50.42,63.4 41.4,54.38 37.97,54.38
PB15: length 42.4
  Top Layer w0.254: LED3.2 62.23,48.92 58.8,52.35 58.8,60.47 57.15,62.13 51.31,62.13 41.02,51.84 H1.17
$1N1996: length 6.7
  Top Layer w0.254: LED1.1 75.08,65.05 75.14,65.11
$1N2069: length 6.7
  Top Layer w0.254: 75.14,48.91 75.14,48.92 LED3.1
$1N2112: length 6.7
  Top Layer w0.254: LED2.1 68.52,57.49 75.14,57.49
$1N6431: length 29.5
  Top Layer w1.016: U12.1 12.95,19.58 16.26,22.88 16.26,34.95 14.41,36.79 DC2.1

## Copper pours and planes (outline as drawn; the poured copper is in the pictures)
GND on Top Layer: -7.62,74.44 99.06,74.44 99.06,-5.82 -7.62,-5.82
GND on Bottom Layer: -9.53,75.59 104.65,75.59 104.65,-5.44 -9.53,-5.44

Small or netless copper shapes (teardrops, artwork), in the pictures only: 54 on Top Layer, 46 on Bottom Layer

## Text on the board
Top Silkscreen Layer: VCC | GND | SCL | SDA | servo_6 | servo_5 | servo_4 | servo_3 | servo_2 | servo_1 | TX1 | RX1 | 5V | TX3 | RX3 | OFF | ON | OLED | 实验室 兴趣小组 | 舵机控制信号 | openmv串口 | 调试串口 | robot arm board | 核心板底座
